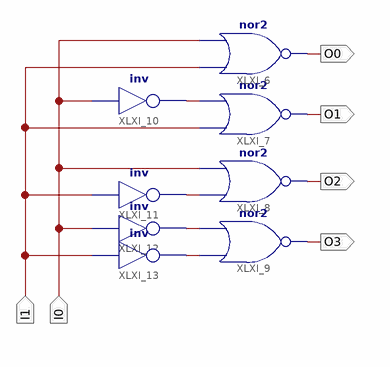
[diagram p0: schematic sheet 1]
// Xilinx ISE schematic Decoder2_4.sch (spartan6) as structural Verilog: 8 symbols, 6 ports
module Decoder2_4 (
  input  I0,
  input  I1,
  output O0,
  output O1,
  output O2,
  output O3
);

  wire XLXN_2, XLXN_3, XLXN_4, XLXN_5;

  nor XLXI_6 (O0, I1, I0);
  nor XLXI_7 (O1, I1, XLXN_2);
  nor XLXI_8 (O2, XLXN_3, I0);
  nor XLXI_9 (O3, XLXN_5, XLXN_4);
  not XLXI_10 (XLXN_2, I0);
  not XLXI_11 (XLXN_3, I1);
  not XLXI_12 (XLXN_4, I0);
  not XLXI_13 (XLXN_5, I1);
endmodule
